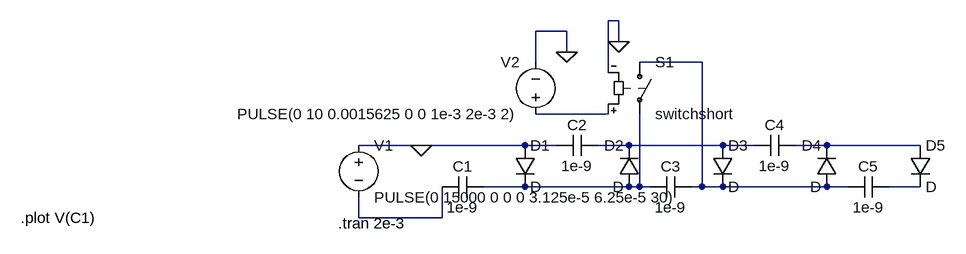
[diagram p0: schematic FailedCapacitor.asc]
FailedCapacitor.asc, the LTspice schematic file:
Version 4
SHEET 1 880 680
WIRE 64 -144 48 -144
WIRE -16 -128 -64 -128
WIRE 64 -112 64 -144
WIRE -16 -96 -16 -128
WIRE -64 -80 -64 -128
WIRE 192 -80 96 -80
WIRE 48 -64 48 -144
WIRE 48 0 48 -16
WIRE 48 0 -64 0
WIRE -240 48 -336 48
WIRE -80 48 -240 48
WIRE -32 48 -80 48
WIRE 80 48 32 48
WIRE 224 48 80 48
WIRE 272 48 224 48
WIRE 384 48 336 48
WIRE 528 48 384 48
WIRE -80 112 -144 112
WIRE 80 112 -80 112
WIRE 96 112 96 0
WIRE 96 112 80 112
WIRE 112 112 96 112
WIRE 192 112 192 -80
WIRE 192 112 176 112
WIRE 224 112 192 112
WIRE 384 112 224 112
WIRE 416 112 384 112
WIRE 528 112 480 112
WIRE -336 160 -336 128
WIRE -208 160 -208 112
WIRE -208 160 -336 160
FLAG -240 48 0
FLAG -16 -96 0
FLAG 64 -112 0
SYMBOL diode -96 48 R0
SYMATTR InstName D1
SYMBOL diode 96 112 R180
WINDOW 0 24 64 Left 2
WINDOW 3 24 0 Left 2
SYMATTR InstName D2
SYMBOL diode 208 48 R0
SYMATTR InstName D3
SYMBOL diode 400 112 R180
WINDOW 0 24 64 Left 2
WINDOW 3 24 0 Left 2
SYMATTR InstName D4
SYMBOL cap -144 96 R90
WINDOW 0 0 32 VBottom 2
WINDOW 3 32 32 VTop 2
SYMATTR InstName C1
SYMATTR Value 1e-9
SYMBOL cap 32 32 R90
WINDOW 0 0 32 VBottom 2
WINDOW 3 32 32 VTop 2
SYMATTR InstName C2
SYMATTR Value 1e-9
SYMBOL cap 176 96 R90
WINDOW 0 0 32 VBottom 2
WINDOW 3 32 32 VTop 2
SYMATTR InstName C3
SYMATTR Value 1e-9
SYMBOL cap 336 32 R90
WINDOW 0 0 32 VBottom 2
WINDOW 3 32 32 VTop 2
SYMATTR InstName C4
SYMATTR Value 1e-9
SYMBOL voltage -336 32 R0
WINDOW 123 0 0 Left 0
WINDOW 39 0 0 Left 0
SYMATTR InstName V1
SYMATTR Value PULSE(0 15000 0 0 0 3.125e-5 6.25e-5 30)
SYMBOL sw 96 -96 R0
SYMATTR InstName S1
SYMATTR Value switchshort
SYMBOL voltage -64 16 R180
WINDOW 0 24 96 Left 2
WINDOW 3 24 16 Left 2
WINDOW 123 0 0 Left 0
WINDOW 39 0 0 Left 0
SYMATTR InstName V2
SYMATTR Value PULSE(0 10 0.0015625 0 0 1e-3 2e-3 2)
SYMBOL cap 480 96 R90
WINDOW 0 0 32 VBottom 2
WINDOW 3 32 32 VTop 2
SYMATTR InstName C5
SYMATTR Value 1e-9
SYMBOL diode 512 48 R0
SYMATTR InstName D5
TEXT -368 168 Left 2 !.tran 2e-3
TEXT -856 160 Left 2 !.plot V(C1)

The netlist it stands for:
* FailedCapacitor.asc
D1 0 N005 D
D2 N005 N003 D
D3 N003 N001 D
D4 N001 N004 D
C1 N005 N007 1e-9
C2 N003 0 1e-9
C3 N001 N005 1e-9
C4 N004 N003 1e-9
V1 0 N007 PULSE(0 15000 0 0 0 3.125e-5 6.25e-5 30)
S1 N001 N005 N002 0 switchshort
V2 N002 0 PULSE(0 10 0.0015625 0 0 1e-3 2e-3 2)
C5 N006 N001 1e-9
D5 N004 N006 D
.model D D
.lib standard.dio
.tran 2e-3
.plot V(C1)
.backanno
.end